# Altium schematic sheet 5.SchDoc
size A4; SheetNumber: 5; SheetTotal: 6
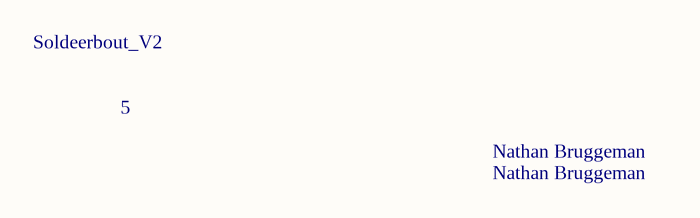
[diagram p0: 5.SchDoc]

## Notes on the sheet
- Soldeerbout_V2
- 5
- Nathan Bruggeman